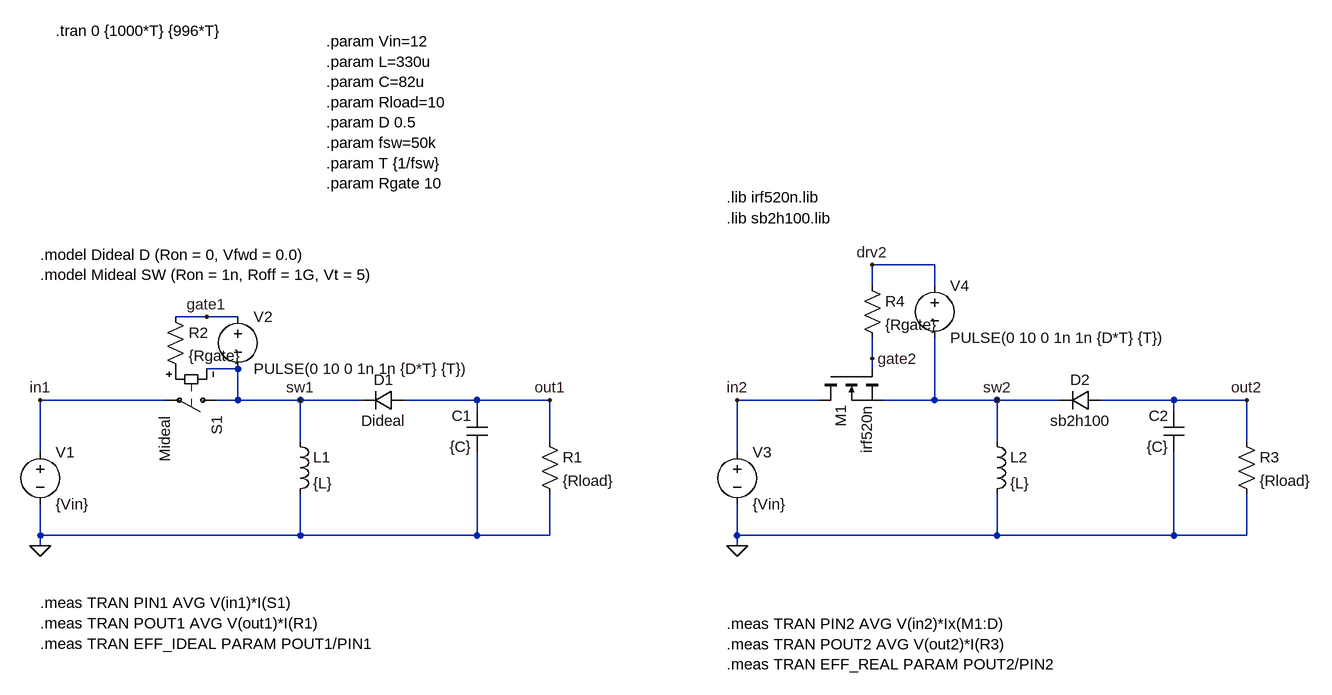
[diagram p0: schematic buckBoostRealDiodeAndMosfet.asc]
buckBoostRealDiodeAndMosfet.asc, the LTspice schematic file:
Version 4
SHEET 1 2852 1772
WIRE 1392 -128 1296 -128
WIRE 1296 -96 1296 -128
WIRE 1392 -96 1392 -128
WIRE 272 -48 224 -48
WIRE 320 -48 272 -48
WIRE 1296 16 1296 -16
WIRE 320 32 272 32
WIRE 1296 32 1296 16
WIRE 208 80 16 80
WIRE 320 80 320 32
WIRE 320 80 288 80
WIRE 416 80 320 80
WIRE 512 80 416 80
WIRE 688 80 576 80
WIRE 800 80 688 80
WIRE 1216 80 1088 80
WIRE 1392 80 1392 -16
WIRE 1392 80 1312 80
WIRE 1488 80 1392 80
WIRE 1584 80 1488 80
WIRE 1760 80 1648 80
WIRE 1872 80 1760 80
WIRE 688 96 688 80
WIRE 1760 96 1760 80
WIRE 416 144 416 80
WIRE 800 144 800 80
WIRE 1488 144 1488 80
WIRE 1872 144 1872 80
WIRE 16 160 16 80
WIRE 1088 160 1088 80
WIRE 16 288 16 240
WIRE 416 288 416 224
WIRE 416 288 16 288
WIRE 688 288 688 160
WIRE 688 288 416 288
WIRE 800 288 800 224
WIRE 800 288 688 288
WIRE 1088 288 1088 240
WIRE 1488 288 1488 224
WIRE 1488 288 1088 288
WIRE 1760 288 1760 160
WIRE 1760 288 1488 288
WIRE 1872 288 1872 224
WIRE 1872 288 1760 288
WIRE 16 304 16 288
WIRE 1088 304 1088 288
FLAG 16 304 0
FLAG 800 80 out1
FLAG 16 80 in1
FLAG 416 80 sw1
FLAG 1088 304 0
FLAG 1872 80 out2
FLAG 1088 80 in2
FLAG 1488 80 sw2
FLAG 272 -48 gate1
FLAG 1296 -128 drv2
FLAG 1296 16 gate2
SYMBOL voltage 16 144 R0
WINDOW 123 0 0 Left 0
WINDOW 39 0 0 Left 0
SYMATTR InstName V1
SYMATTR Value {Vin}
SYMBOL res 784 128 R0
SYMATTR InstName R1
SYMATTR Value {Rload}
SYMBOL ind 400 128 R0
SYMATTR InstName L1
SYMATTR Value {L}
SYMBOL cap 704 160 R180
WINDOW 0 24 56 Left 2
WINDOW 3 24 8 Left 2
SYMATTR InstName C1
SYMATTR Value {C}
SYMBOL diode 576 64 R90
WINDOW 0 0 32 VBottom 2
WINDOW 3 32 32 VTop 2
SYMATTR InstName D1
SYMATTR Value Dideal
SYMBOL sw 304 80 R90
SYMATTR InstName S1
SYMATTR Value Mideal
SYMBOL voltage 320 -64 R0
WINDOW 123 0 0 Left 0
WINDOW 39 0 0 Left 0
SYMATTR InstName V2
SYMATTR Value PULSE(0 10 0 1n 1n {D*T} {T})
SYMBOL voltage 1088 144 R0
WINDOW 123 0 0 Left 0
WINDOW 39 0 0 Left 0
SYMATTR InstName V3
SYMATTR Value {Vin}
SYMBOL res 1856 128 R0
SYMATTR InstName R3
SYMATTR Value {Rload}
SYMBOL ind 1472 128 R0
SYMATTR InstName L2
SYMATTR Value {L}
SYMBOL cap 1776 160 R180
WINDOW 0 24 56 Left 2
WINDOW 3 24 8 Left 2
SYMATTR InstName C2
SYMATTR Value {C}
SYMBOL voltage 1392 -112 R0
WINDOW 123 0 0 Left 0
WINDOW 39 0 0 Left 0
SYMATTR InstName V4
SYMATTR Value PULSE(0 10 0 1n 1n {D*T} {T})
SYMBOL diode 1648 64 R90
WINDOW 0 0 32 VBottom 2
WINDOW 3 32 32 VTop 2
SYMATTR InstName D2
SYMATTR Value sb2h100
SYMATTR Prefix X
SYMBOL res 208 -64 R0
SYMATTR InstName R2
SYMATTR Value {Rgate}
SYMBOL res 1280 -112 R0
SYMATTR InstName R4
SYMATTR Value {Rgate}
SYMBOL nmos 1216 32 M90
SYMATTR InstName M1
SYMATTR Value irf520n
SYMATTR Prefix X
TEXT 456 -472 Left 2 !.param Vin=12 \n.param L=330u \n.param C=82u \n.param Rload=10 \n.param D 0.5\n.param fsw=50k\n.param T {1/fsw}\n.param Rgate 10
TEXT 40 -488 Left 2 !.tran 0 {1000*T} {996*T}
TEXT 16 -144 Left 2 !.model Dideal D (Ron = 0, Vfwd = 0.0)\n.model Mideal SW (Ron = 1n, Roff = 1G, Vt = 5)
TEXT 1072 -232 Left 2 !.lib irf520n.lib
TEXT 1072 -200 Left 2 !.lib sb2h100.lib
TEXT 16 392 Left 2 !.meas TRAN PIN1 AVG V(in1)*I(S1)\n.meas TRAN POUT1 AVG V(out1)*I(R1)\n.meas TRAN EFF_IDEAL PARAM POUT1/PIN1
TEXT 1072 424 Left 2 !.meas TRAN PIN2 AVG V(in2)*Ix(M1:D)\n.meas TRAN POUT2 AVG V(out2)*I(R3)\n.meas TRAN EFF_REAL PARAM POUT2/PIN2

The netlist it stands for:
* buckBoostRealDiodeAndMosfet.asc
V1 in1 0 {Vin}
R1 out1 0 {Rload}
L1 sw1 0 {L}
C1 0 out1 {C}
D1 out1 sw1 Dideal
S1 sw1 in1 P001 sw1 Mideal
V2 gate1 sw1 PULSE(0 10 0 1n 1n {D*T} {T})
V3 in2 0 {Vin}
R3 out2 0 {Rload}
L2 sw2 0 {L}
C2 0 out2 {C}
V4 drv2 sw2 PULSE(0 10 0 1n 1n {D*T} {T})
XD2 out2 sw2 sb2h100  ; pins + -
R2 gate1 P001 {Rgate}
R4 drv2 gate2 {Rgate}
XM1 in2 gate2 sw2 irf520n  ; pins D G S
.model D D
.lib standard.dio
.param Vin=12
.param L=330u
.param C=82u
.param Rload=10
.param D 0.5
.param fsw=50k
.param T {1/fsw}
.param Rgate 10
.tran 0 {1000*T} {996*T}
.model Dideal D (Ron = 0, Vfwd = 0.0)
.model Mideal SW (Ron = 1n, Roff = 1G, Vt = 5)
.lib irf520n.lib
.lib sb2h100.lib
.meas TRAN PIN1 AVG V(in1)*I(S1)
.meas TRAN POUT1 AVG V(out1)*I(R1)
.meas TRAN EFF_IDEAL PARAM POUT1/PIN1
.meas TRAN PIN2 AVG V(in2)*Ix(M1:D)
.meas TRAN POUT2 AVG V(out2)*I(R3)
.meas TRAN EFF_REAL PARAM POUT2/PIN2
.backanno
.end